# Altium schematic sheet Zynq DDR3.SchDoc
size Tabloid; ApprovedBy: NA
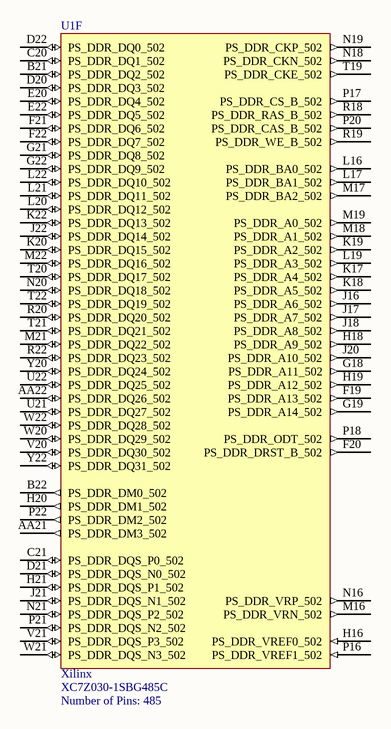
[diagram p0: Zynq DDR3.SchDoc]

## Parts
U1  Manufacturer: Xilinx  Manufacturer Part Number: XC7Z030-1SBG485C  Number of Pins: 485  [SBG484]  (hidden comment: U_XNLX-XC7Z030-1SBG485C)  (part F of 10)

## Nets

Not connected (* = marked no-connect by the designer): U1 AA21(PS_DDR_DM3_502) AA22(PS_DDR_DQ26_502) B21(PS_DDR_DQ2_502) B22(PS_DDR_DM0_502) C20(PS_DDR_DQ1_502) C21(PS_DDR_DQS_P0_502) D20(PS_DDR_DQ3_502) D21(PS_DDR_DQS_N0_502) D22(PS_DDR_DQ0_502) E20(PS_DDR_DQ4_502) E22(PS_DDR_DQ5_502) F19(PS_DDR_A13_502) F20(PS_DDR_DRST_B_502) F21(PS_DDR_DQ6_502) F22(PS_DDR_DQ7_502) G18(PS_DDR_A11_502) G19(PS_DDR_A14_502) G21(PS_DDR_DQ8_502) G22(PS_DDR_DQ9_502) H16(PS_DDR_VREF0_502) H18(PS_DDR_A9_502) H19(PS_DDR_A12_502) H20(PS_DDR_DM1_502) H21(PS_DDR_DQS_P1_502) J16(PS_DDR_A6_502) J17(PS_DDR_A7_502) J18(PS_DDR_A8_502) J20(PS_DDR_A10_502) J21(PS_DDR_DQS_N1_502) J22(PS_DDR_DQ14_502) K17(PS_DDR_A4_502) K18(PS_DDR_A5_502) K19(PS_DDR_A2_502) K20(PS_DDR_DQ15_502) K22(PS_DDR_DQ13_502) L16(PS_DDR_BA0_502) L17(PS_DDR_BA1_502) L19(PS_DDR_A3_502) L20(PS_DDR_DQ12_502) L21(PS_DDR_DQ11_502) L22(PS_DDR_DQ10_502) M16(PS_DDR_VRN_502) M17(PS_DDR_BA2_502) M18(PS_DDR_A1_502) M19(PS_DDR_A0_502) M21(PS_DDR_DQ22_502) M22(PS_DDR_DQ16_502) N16(PS_DDR_VRP_502) N18(PS_DDR_CKN_502) N19(PS_DDR_CKP_502) N20(PS_DDR_DQ18_502) N21(PS_DDR_DQS_P2_502) P16(PS_DDR_VREF1_502) P17(PS_DDR_CS_B_502) P18(PS_DDR_ODT_502) P20(PS_DDR_CAS_B_502) P21(PS_DDR_DQS_N2_502) P22(PS_DDR_DM2_502) R18(PS_DDR_RAS_B_502) R19(PS_DDR_WE_B_502) R20(PS_DDR_DQ20_502) R22(PS_DDR_DQ23_502) T19(PS_DDR_CKE_502) T20(PS_DDR_DQ17_502) T21(PS_DDR_DQ21_502) T22(PS_DDR_DQ19_502) U21(PS_DDR_DQ27_502) U22(PS_DDR_DQ25_502) V20(PS_DDR_DQ30_502) V21(PS_DDR_DQS_P3_502) W20(PS_DDR_DQ29_502) W21(PS_DDR_DQS_N3_502) W22(PS_DDR_DQ28_502) Y20(PS_DDR_DQ24_502) Y22(PS_DDR_DQ31_502)

## Notes on the sheet
- Project:
- http://www.cospandesign.com
- Cospan Design
- Document:
- Engineer:
- Title:
- Client:
- Approved By:
- Revision:
- Date:
- Number:
- of

## Library data of the parts
U1 = U_XNLX-XC7Z030-1SBG485C: MPU Zynq-7000 RISC 32-Bit 667MHz 1.5V/2V/2.5V 485-Pin FBGA; Speed Grade: -1; RAM Size: 256KB; Number of I/Os: 130; Interface: I2C,SPI,USB,CAN,Ethernet,MMC,SDIO,SD,UART,USART,EBI/EMI; Data Bus Width: 32b; Peripherals: DMA; Supplier 1: Digikey; Stock 1: 102; Pricing 1: 1=230.1 (USD); Case/Package: FBGA; Contact Plating: Copper,Tin,Silver; Min Operating Temperature: 0°C; Max Operating Temperature: 85°C; Packaging: Tray; Frequency: 667MHz; Max Frequency: 667MHz; ComponentLink1URL: https://datasheet.ciiva.com/48476/ds190-zynq-7000-overview-48476904.pdf; ComponentLink1Description: https://datasheet.ciiva.com/48476/ds190-zynq-7000-overview-48476904.pdf; Supplier Part Number 1: 122-1924-ND